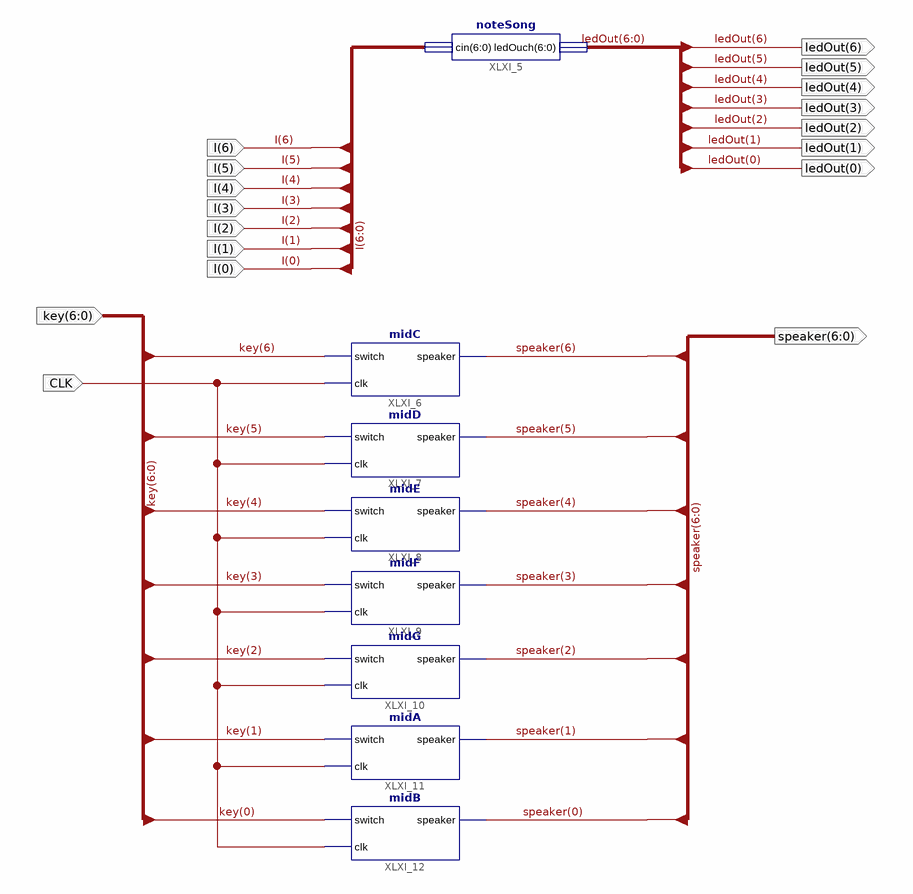
[diagram p0: schematic sheet 1]
// Xilinx ISE schematic project2.sch (spartan6) as structural Verilog: 8 symbols, 17 ports
module project2 (
  input  CLK,
  input  [6:0] key,
  input  [6:0] I,
  output [6:0] speaker,
  output [6:0] ledOut
);

  noteSong XLXI_5 (.cin(I), .ledOuch(ledOut));
  midC XLXI_6 (.switch(key[6]), .clk(CLK), .speaker(speaker[6]));
  midD XLXI_7 (.switch(key[5]), .clk(CLK), .speaker(speaker[5]));
  midE XLXI_8 (.switch(key[4]), .clk(CLK), .speaker(speaker[4]));
  midF XLXI_9 (.switch(key[3]), .clk(CLK), .speaker(speaker[3]));
  midG XLXI_10 (.switch(key[2]), .clk(CLK), .speaker(speaker[2]));
  midA XLXI_11 (.switch(key[1]), .clk(CLK), .speaker(speaker[1]));
  midB XLXI_12 (.switch(key[0]), .clk(CLK), .speaker(speaker[0]));
endmodule
